# EAGLE design IMArduino-v1 (EAGLE 9.2.0)
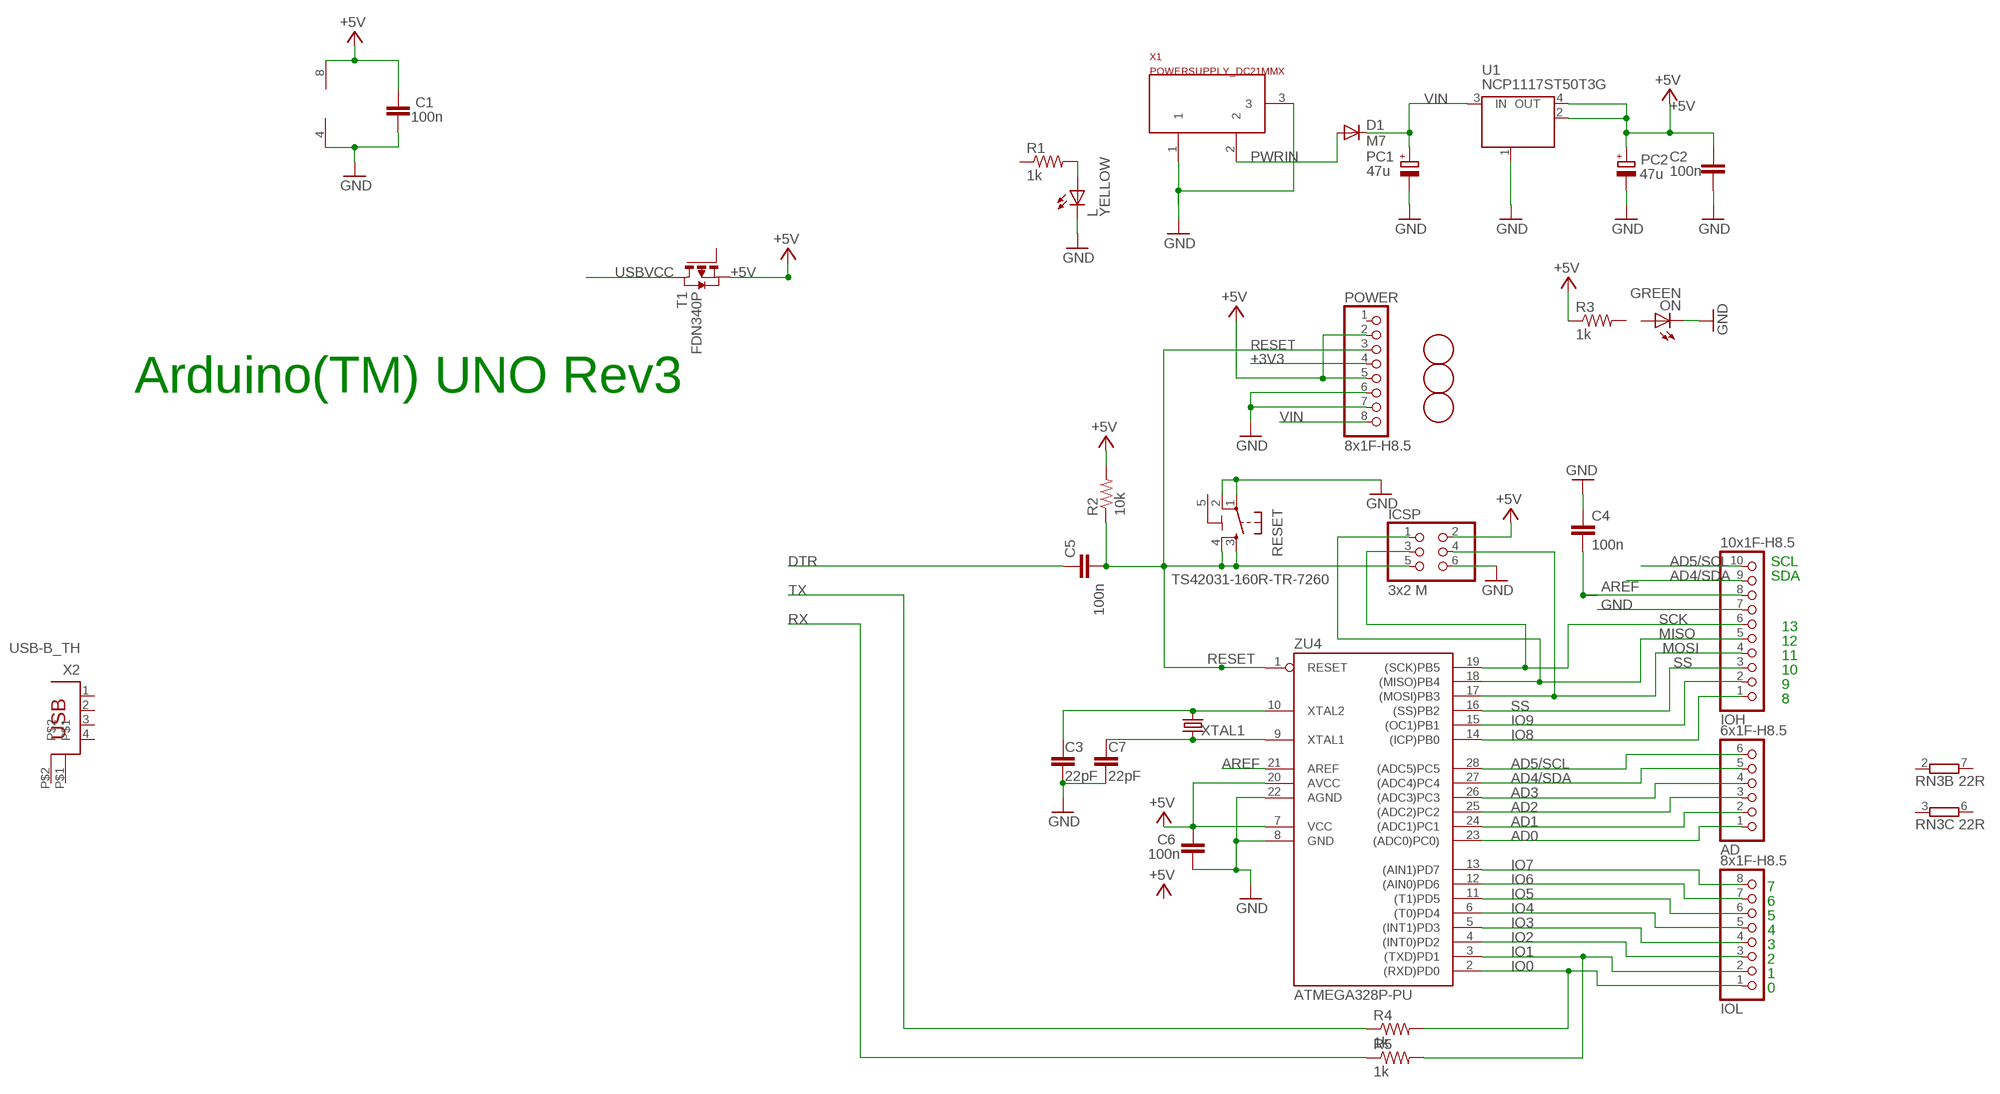
[diagram p0: schematic, sheet 1]

## Parts
AD  6x1F-H8.5  PINHD-1X6  [1X06]
C1  100n  C-EU0603-RND  [C0603-ROUND]
C2  100n  C-EU0603-RND  [C0603-ROUND]
C3  22pF  C-EU0603-RND  [C0603-ROUND]
C4  100n  C-EU0603-RND  [C0603-ROUND]
C5  100n  C-EU0603-RND  [C0603-ROUND]
C6  100n  C-EU0603-RND  [C0603-ROUND]
C7  22pF  C-EU0603-RND  [C0603-ROUND]
D1  M7  DIODE-SMB  [SMB]
FD1  FIDUCIALMOUNT  [FIDUCIA-MOUNT]
FD2  FIDUCIALMOUNT  [FIDUCIA-MOUNT]
FD3  FIDUCIALMOUNT  [FIDUCIA-MOUNT]
ICSP  3x2 M  PINHD-2X3  [2X03]
IOH  10x1F-H8.5  PINHD-1X10_ARD  [1X10]
IOL  8x1F-H8.5  PINHD-1X8  [1X08]
L  YELLOW  LEDCHIP-LED0805  [CHIP-LED0805]
ON  GREEN  LEDCHIP-LED0805  [CHIP-LED0805]
PC1  47u  CPOL-EUD  [PANASONIC_D]
PC2  47u  CPOL-EUD  [PANASONIC_D]
POWER  8x1F-H8.5  PINHD-1X8  [1X08]
R1  1k  R-US_0204/7  [0204/7]
R2  10k  R-US_0204/7  [0204/7]
R3  1k  R-US_0204/7  [0204/7]
R4  1k  R-US_0204/7  [0204/7]
R5  1k  R-US_0204/7  [0204/7]
RESET  TS42031-160R-TR-7260  TS42  [TS42]
RN3  22R  4R-NCAY16  [CAY16]
T1  FDN340P  PMOSSOT23  [SOT-23]
U1  NCP1117ST50T3G  MC33269ST-3.3T3  [SOT223]
U5  LMV358IDGKR  LMV358MMX  [MSOP08]
X1  POWERSUPPLY_DC21MMX  [POWERSUPPLY_DC-21MM]
X2  USB-B_TH  PN61729  [PN61729]
XTAL1  CRYSTALHC49U-V  [HC49U-V]
ZU4  ATMEGA328P-PU  [DIL28-3]

## Nets
+3V3: POWER.4
+5V [usbvcc]: C1.2 C2.2 C6.2 ICSP.2 PC2.+ POWER.2 POWER.5 R2.2 R3.1 T1.2(S) U1.2(OUT) U1.4(OUT) U5.8(P:V+) ZU4.7(VCC) ZU4.20(AVCC)
AD0: AD.1 ZU4.23((ADC0)PC0))
AD1: AD.2 ZU4.24((ADC1)PC1)
AD2: AD.3 ZU4.25((ADC2)PC2)
AD3: AD.4 ZU4.26((ADC3)PC3)
AD4/SDA: AD.5 IOH.9 ZU4.27((ADC4)PC4)
AD5/SCL: AD.6 IOH.10 ZU4.28((ADC5)PC5)
AREF [aref]: C4.2 IOH.8 ZU4.21(AREF)
DTR: C5.1
GND [gnd]: C1.1 C2.1 C3.1 C4.1 C6.1 C7.1 ICSP.6 IOH.7 L.C ON.C PC1.- PC2.- POWER.6 POWER.7 RESET.1 RESET.2 U1.1(GND/ADJ) U5.4(P:V-) X1.1 X1.3 ZU4.8(GND) ZU4.22(AGND)
IO0: IOL.1 R4.2 ZU4.2((RXD)PD0)
IO1: IOL.2 R5.2 ZU4.3((TXD)PD1)
IO2: IOL.3 ZU4.4((INT0)PD2)
IO3: IOL.4 ZU4.5((INT1)PD3)
IO4: IOL.5 ZU4.6((T0)PD4)
IO5: IOL.6 ZU4.11((T1)PD5)
IO6: IOL.7 ZU4.12((AIN0)PD6)
IO7: IOL.8 ZU4.13((AIN1)PD7)
IO8: IOH.1 ZU4.14((ICP)PB0)
IO9: IOH.2 ZU4.15((OC1)PB1)
MISO: ICSP.1 IOH.5 ZU4.18((MISO)PB4)
MOSI: ICSP.4 IOH.4 ZU4.17((MOSI)PB3)
N$1: L.A R1.2
PWRIN [power]: D1.A X1.2
RESET: C5.2 ICSP.5 POWER.3 R2.1 RESET.3 RESET.4 ZU4.1(RESET)
RX: R5.1
SCK: ICSP.3 IOH.6 ZU4.19((SCK)PB5)
SS: IOH.3 ZU4.16((SS)PB2)
TX: R4.1
USBVCC [usbvcc]: T1.1(D)
VIN [power]: D1.C PC1.+ POWER.8 U1.3(IN)
XTAL1: C7.2 XTAL1.1 ZU4.9(XTAL1)
XTAL2: C3.2 XTAL1.2 ZU4.10(XTAL2)
Unconnected: ON.A POWER.1 R1.1 R3.2 RN3.1 RN3.2 RN3.3 RN3.4 RN3.5 RN3.6 RN3.7 RN3.8 T1.3(G) U5.1(A:OUT) U5.2(A:-IN) U5.3(A:+IN) U5.5(B:+IN) U5.6(B:-IN) U5.7(B:OUT) X2.1 X2.2 X2.3 X2.4 X2.P$1 X2.P$2

## Notes on the sheet
- Arduino(TM) UNO Rev3
- SCL
- SDA
- 13
- 12
- 11
- 10
- 9
- 8
- 7
- 6
- 5
- 4
- 3
- 2
- 1
- 0

## Power pins joined to a net without a drawn wire
5-GND: RESET.5(5-GND)

## Library data of the parts
AD = SmartPrj:PINHD-1X6: PIN HEADER
C1-C7 = SmartPrj:C-EU: CAPACITOR, European symbol
D1 = diode:DIODE-: DIODE
FD1-FD3 = SmartPrj:FIDUCIALMOUNT
ICSP = SmartPrj:PINHD-2X3: PIN HEADER
IOH = SmartPrj:PINHD-1X10_ARD: PIN HEADER
IOL POWER = SmartPrj:PINHD-1X8: PIN HEADER
L ON = led:LED: LED OSRAM: - CHIPLED LG R971, LG N971, LY N971, LG Q971, LY Q971, LO R971, LY R971 LH N974, LH R974 LS Q976, LO Q976, LY Q976 LO Q996 - Hyper CHIPLED LW Q18S LB Q993, LB Q99A, LB R99A - SideLED LS A670, LO A670, LY A670, LG A670, LP A670 LB A673, LV A673, LT A673, LW A673 LH A674 LY A675 LS A676, LA A676, LO A676, LY A676, LW A676 LS A679, LY A679, LG A679 - Hyper Micro SIDELED® LS Y876, LA Y876, LO Y876, LY Y876 LT Y87S - SmartLED LW L88C, LW L88S LB L89C, LB L89S, LG L890 LS L89K, LO L89K, LY L89K LS L896, LA L896, LO L896, LY L896 - TOPLED LS T670, LO T670, LY T670, LG T670, LP T670 LSG T670, LSP T670, LSY T670, LOP T670, LYG T670 LG T671, LOG T671, LSG T671 LB T673, LV T673, LT T673, LW T673 LH T674 LS T676, LA T676, LO T676, LY T676, LB T676, LH T676, LSB T676, LW T676 LB T67C, LV T67C, LT T67C, LS T67K, LO T67K, LY T67K, LW E67C LS E67B, LA E67B, LO E67B, LY E67B, LB E67C, LV E67C, LT E67C LW T67C LS T679, LY T679, LG T679 LS T770, LO T770, LY T770, LG T770, LP T770 LB T773, LV T773, LT T773, LW T773 LH T774 LS E675, LA E675, LY E675, LS T675 LS T776, LA T776, LO T776, LY T776, LB T776 LHGB T686 LT T68C, LB T68C - Hyper Mini TOPLED® LB M676 - Mini TOPLED Santana® LG M470 LS M47K, LO M47K, LY M47K Source: http://www.osram.convergy.de LUXEON: - LUMILED® LXK2-PW12-R00, LXK2-PW12-S00, LXK2-PW14-U00, LXK2-PW14-V00 LXK2-PM12-R00, LXK2-PM12-S00, LXK2-PM14-U00 LXK2-PE12-Q00, LXK2-PE12-R00, LXK2-PE12-S00, LXK2-PE14-T00, LXK2-PE14-U00 LXK2-PB12-K00, LXK2-PB12-L00, LXK2-PB12-M00, LXK2-PB14-N00, LXK2-PB14-P00, LXK2-PB14-Q00 LXK2-PR12-L00, LXK2-PR12-M00, LXK2-PR14-Q00, LXK2-PR14-R00 LXK2-PD12-Q00, LXK2-PD12-R00, LXK2-PD12-S00 LXK2-PH12-R00, LXK2-PH12-S00 LXK2-PL12-P00, LXK2-PL12-Q00, LXK2-PL12-R00 Source: www.luxeon.com KINGBRIGHT: KA-3528ASYC Source: www.kingbright.com
PC1 PC2 = rcl:CPOL-EU: POLARIZED CAPACITOR, European symbol
R1-R5 = adafruit:R-US_: RESISTOR, American symbol
RESET = SmartPrj:TS42: TS42 Dongnan Electronics Tact switch VDC 12V - 50mA
RN3 = resistor-dil:4R-N: Array Chip Resistor Source: RS Component / Phycomp
T1 = zetex:PMOSSOT23: MOS FET
U1 = linear:MC33269ST*: Adjustable Output Low Dropout Voltage Regulator 800 mA Source: http://www.onsemi.com/pub/Collateral/MC33269-D.PDF
U5 = linear:LMV358?*: Dual General Purpose, Low Voltage, Rail-to-Rail Output Operational Amplifiers Source: http://www.national.com/mpf/LM/LMV321.html http://www.national.com/dt/lmv_qual.pdf
X1 = SmartPrj:POWERSUPPLY_DC21MM
X2 = SmartPrj:PN61729: BERG USB connector
XTAL1 = adafruit:CRYSTAL: CRYSTAL; OC_FARNELL: 1666969; OC_NEWARK: unknown
ZU4 = SmartPrj:ATMEGA328P-: MICROCONTROLLER 4 Kbytes FLASH 128 bytes SRAM 256 bytes EEPROM UART 6-channel 10 bit ADC

## Net classes
0 default: width 0.254 mm, clearance 0.254 mm
1 power: width 0.61 mm, drill 0.61 mm, clearance 0.254 mm
2 gnd: width 0.305 mm, drill 0.559 mm, clearance 0.254 mm
3 usbvcc: width 0.508 mm, drill 0.61 mm, clearance 0.254 mm
4 aref: width 0.406 mm, drill 0.61 mm, clearance 0.254 mm

## Board
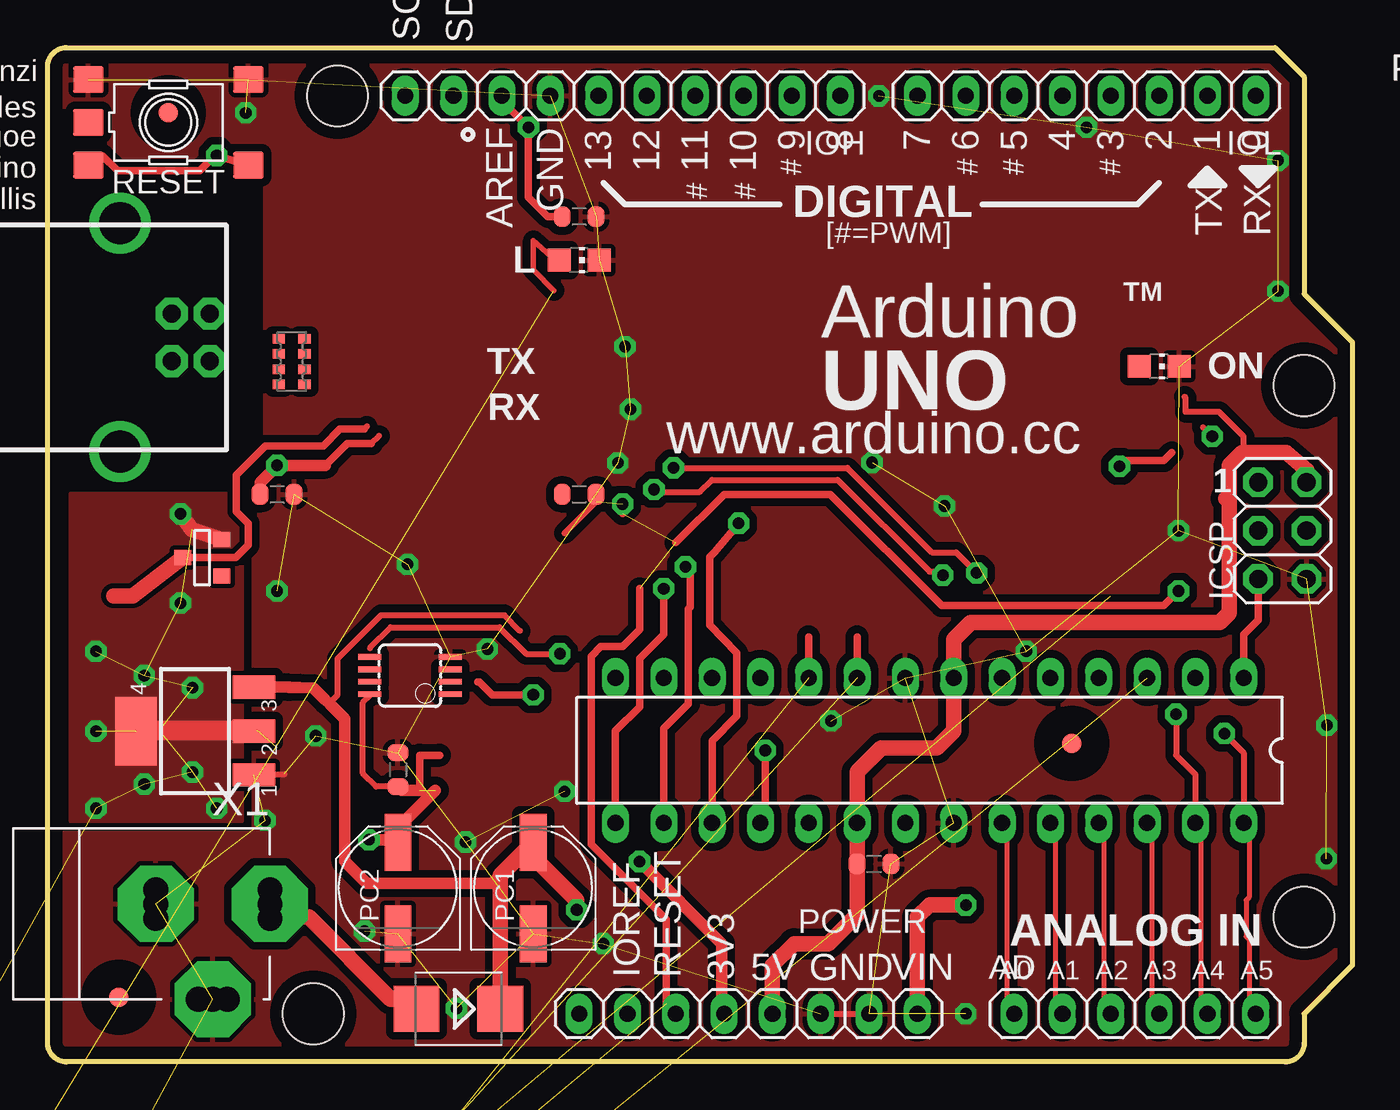
[diagram p1: board, top side]
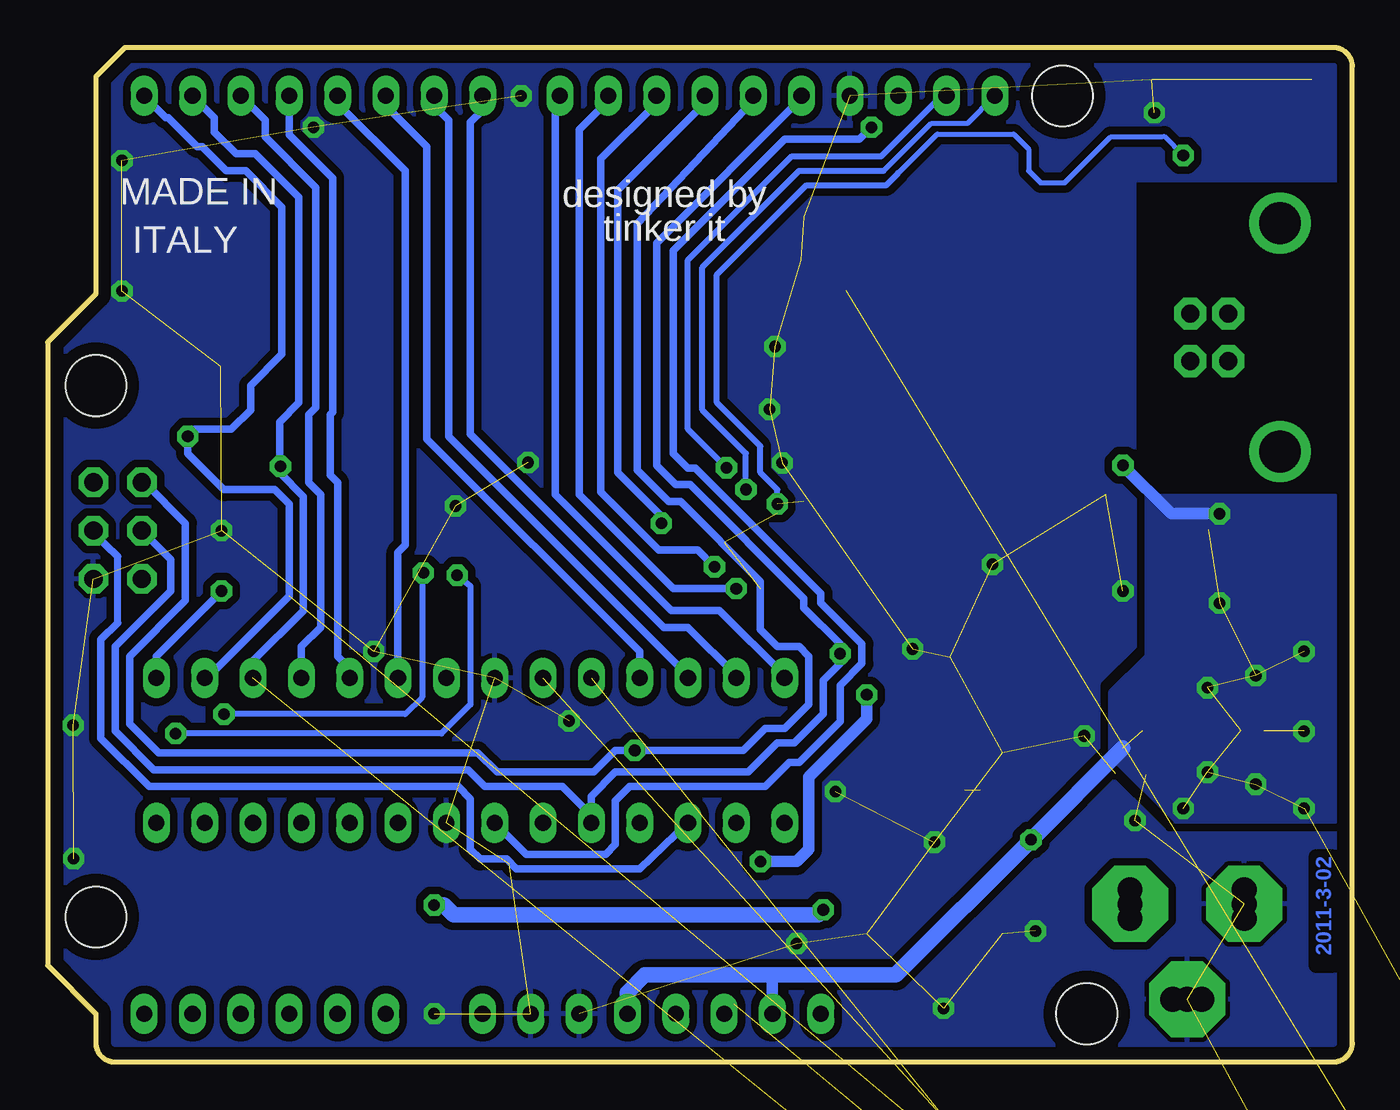
[diagram p2: board, bottom side, seen from below]

Size 68.58 x 53.34 mm. Coordinates in mm from the lower left corner, seen from the top.
Outline: 64.52,53.34 66.04,51.82 66.04,40.39 68.58,37.85 68.58,5.08 66.04,2.54 66.04,1 arc-90 65.04,0 1,0 arc-90 0,1 0,52.34 arc-90 1,53.34 64.52,53.34
Copper layers (1*16): Top 0.035mm / dielectric 1.5mm / Bottom 0.035mm
Design rules "default": minimum track width 10mil, minimum drill 22mil, track to track 10mil, track to pad 10mil, pad to pad 10mil, via to via 12mil, smd to smd 8mil, copper to edge 26mil, drill to drill 12mil, minimum pad ring 10mil, minimum via ring 10mil, stop-mask expansion 1mil, vias tented up to drill 30mil, thermal gap 10mil
Holes 3.2 mm at 66.04,35.56 66.04,7.62 15.24,50.8 13.97,2.54
vRestrict: area 22.9,44.1 to 24.6,49.1; area 25.4,45.5 to 27.1,49.1; area 28.4,45.3 to 29.6,48.8; area 31,45.3 to 32.1,48.8; area 33.5,45.3 to 34.7,48.8; area 36.1,45.3 to 37.2,48.8; area 38.7,47.2 to 39.9,48.8; area 40.3,45.1 to 47.6,46.9; area 60.3,44.2 to 61.7,46.7; area 62.9,44.2 to 64.3,46.7; area 61.3,35.8 to 64.8,37.2; area 0.6,21.8 to 2,30.1; area 5.7,22.6 to 7.4,30.1; area 47.9,10.3 to 48.5,10.8; area 50.4,10.2 to 50.9,11; area 11.3,28.8 to 12.7,31.1; area 44.8,47.5 to 46.1,48.9; area 47.6,47.4 to 48.8,48.9; area 50.2,47.4 to 51.3,48.9; area 52.8,47.4 to 54,48.9; area 55.2,47.4 to 56.4,48.9; area 57.9,47.4 to 59.1,48.9; area 60.5,47.4 to 61.6,48.9; area 63,47.4 to 64.1,48.9; area 41.3,47.2 to 42.4,48.8; area 0.3,12.4 to 9.4,24.5

### Footprints (pad centres in the part's own frame; a part is rotated, then mirrored left to right if it is on the bottom)
1X06 = drill 0.85 pad 1.422 long: 1 -6.35,0; 2 -3.81,0; 3 -1.27,0; 4 1.27,0; 5 3.81,0; 6 6.35,0
C0603-ROUND = smd 0.898 x 1.1: 1 -0.889,0; 2 0.889,0
SMB = smd 2.4 x 2.4: A 2.2,0; C -2.2,0
FIDUCIA-MOUNT = smd 1.016 x 1.016: P$1 0,0
2X03 = drill 0.95 pad 1.55 octagon: 1 -2.54,-1.27; 2 -2.54,1.27; 3 0,-1.27; 4 0,1.27; 5 2.54,-1.27; 6 2.54,1.27
1X10 = drill 0.85 pad 1.422 long: 1 -11.43,0; 2 -8.89,0; 3 -6.35,0; 4 -3.81,0; 5 -1.27,0; 6 1.27,0; 7 3.81,0; 8 6.35,0; 9 8.89,0; 10 11.43,0
1X08 = drill 0.85 pad 1.422 long: 1 -8.89,0; 2 -6.35,0; 3 -3.81,0; 4 -1.27,0; 5 1.27,0; 6 3.81,0; 7 6.35,0; 8 8.89,0
CHIP-LED0805 = smd 1.2 x 1.2: A 0,-1.05; C 0,1.05
PANASONIC_D = smd 3 x 1.4: + 2.4,0; - -2.4,0
0204/7 = drill 0.813 pad 1.676 octagon: 1 -3.81,0; 2 3.81,0
TS42 = smd 1.6 x 1.4: 1 -4.2,2.25; 2 4.2,2.25; 3 -4.2,-2.25; 4 4.2,-2.25; 5 -4.2,0
CAY16 = smd 0.5 x 0.65: 1 -1.2,-0.675; 2 -0.4,-0.675; 3 0.4,-0.675; 4 1.2,-0.675; 5 1.2,0.675; 6 0.4,0.675; 7 -0.4,0.675; 8 -1.2,0.675
SOT-23 = smd 0.787 x 0.889: 1 0.025,-1.016; 2 -0.94,1.016; 3 0.991,1.016
SOT223 = smd 1.219 x 2.235: 1 -2.311,-3.099; 2 0,-3.099; 3 2.311,-3.099 | smd 3.6 x 2.2: 4 0,3.099
MSOP08 = smd 0.3 x 1.2: 1 -0.976,-2.113; 2 -0.326,-2.113; 3 0.324,-2.113; 4 0.974,-2.113; 5 0.974,2.112; 6 0.324,2.112; 7 -0.326,2.112; 8 -0.976,2.112
POWERSUPPLY_DC-21MM = drill 1.3 pad 4 octagon: 1 -5.08,-3.353; 2 -0.076,-6.35; 3 -0.076,-0.356 | drill 1.3: 4 -5.08,-4.115; 5 -5.08,-2.591; 6 -0.838,-0.356; 7 0.686,-0.356; 8 -0.838,-6.35; 9 0.686,-6.35
PN61729 = drill 0.95 pad 1.676 octagon: 1 1.25,4.71; 2 -1.25,4.71; 3 -1.25,2.71; 4 1.25,2.71 | drill 2.2: P$1 -6,0; P$2 6,0
HC49U-V = drill 0.813: 1 -2.413,0; 2 2.413,0
DIL28-3 = drill 0.85 pad 1.422 long: 1 -16.51,-3.81; 2 -13.97,-3.81; 3 -11.43,-3.81; 4 -8.89,-3.81; 5 -6.35,-3.81; 6 -3.81,-3.81; 7 -1.27,-3.81; 8 1.27,-3.81; 9 3.81,-3.81; 10 6.35,-3.81; 11 8.89,-3.81; 12 11.43,-3.81; 13 13.97,-3.81; 14 16.51,-3.81; 15 16.51,3.81; 16 13.97,3.81; 17 11.43,3.81; 18 8.89,3.81; 19 6.35,3.81; 20 3.81,3.81; 21 1.27,3.81; 22 -1.27,3.81; 23 -3.81,3.81; 24 -6.35,3.81; 25 -8.89,3.81; 26 -11.43,3.81; 27 -13.97,3.81; 28 -16.51,3.81

### Placement (x,y rotation side)
AD  57.15,2.54 0 top
C1  18.41,15.37 270 top
C2  12.06,29.84 180 top
C3  -21.21,-53.34 0 top  (outside the outline)
C4  27.94,44.45 180 top
C5  27.94,29.84 0 top
C6  43.43,10.41 180 top
C7  -21.21,-58.55 0 top  (outside the outline)
D1  21.59,2.79 180 top
FD1  6.35,49.91 0 top
FD2  53.84,16.74 0 top
FD3  3.73,3.41 0 top
ICSP  64.9,27.94 270 top
IOH  30.23,50.8 180 top
IOL  54.61,50.8 180 top
L  27.94,42.16 270 top
ON  58.42,36.58 270 top
PC1  25.53,9.14 90 top
PC2  18.41,9.14 90 top
POWER  36.83,2.54 0 top
R1  -17.91,-26.29 0 top  (outside the outline)
R2  -17.91,-42.04 0 top  (outside the outline)
R3  -17.91,-30.23 0 top  (outside the outline)
R4  -17.91,-34.16 0 top  (outside the outline)
R5  -17.91,-38.1 0 top  (outside the outline)
RESET  6.35,49.4 0 top
RN3  12.83,36.83 90 top
T1  8.13,26.54 270 top
U1  7.75,17.4 90 top
U5  19.05,20.32 90 top
X1  5.33,8.38 90 top
X2  3.81,38.1 270 top
XTAL1  -17.02,-47.88 0 top  (outside the outline)
ZU4  46.35,16.38 180 top

### Tracks (layer width: path | path; a pad name or v marks a point on that pad's centre or on a via)
+3V3  (via drill 0.61)
  Top 0.406: 22.61,19.99 22.68,19.99 23.37,19.3 v25.53,19.3
  Top 0.61: v31.11,10.54 35.43,6.22 35.43,2.67 POWER.4
  Bottom 0.61: v31.11,10.54 29.21,10.54 28.57,11.18 28.57,14.99 25.53,18.03 v25.53,19.3
+5V  (via drill 0.61)  (14 unrouted)
  Top 0.305: 59.76,34.98 59.82,34.92 59.82,34.18 61.58,34.18 62.87,32.89 62.87,32.05 | 17.02,32.51 17.43,32.92 | U5.8 16.98,19.3 16.57,18.9 16.57,15.18 17.27,14.48 C1.2
  Top 0.406: 42.55,10.16 42.35,10.35 | 17.02,32.51 15.75,32.51 14.61,31.37 | 20.61,16.13 19.56,16.13 19.56,14.29
  Top 0.508: 11.02,17.42 U1.2 | ICSP.2 66.04,30.48
  Top 0.61: C6.2 42.58,10.88 42.55,11.43 | 11.05,29.72 C2.2 11.18,30.48 v12.06,31.37 14.61,31.37 | v16.89,11.68 18.78,11.68 PC2.+ 18.41,12.32 20.39,14.29 | C1.2 18.6,14.29 19.56,14.29
  Top 0.813: 66.17,30.44 ICSP.2 66.17,31.11 65.1,32.05 62.87,32.05 62.79,32.05 62.1,31.37 62.1,29.46 | 62.1,29.46 62.1,23.62 61.59,23.11 48.51,23.11 47.62,22.23 ZU4.7 47.62,17.4 46.74,16.51 43.81,16.51 42.55,15.24 ZU4.20 42.55,11.43 C6.2 42.55,10.16 42.55,7.75 41.02,6.22 39.24,6.22 38.1,5.08 POWER.5 | T1.2 7.57,27.99 v6.99,28.83 | 62.1,29.46 61.93,29.64
  Top 1.016: U1.4 5.84,17.4 5.87,17.42 11.02,17.42
  Bottom 0.61: POWER.2 30.48,4.7 30.61,4.57 | v12.06,31.37 9.53,28.83 v6.99,28.83
  Bottom 0.813: POWER.5 38.12,3.63 37.19,4.57 30.61,4.57 24,4.57 v16.89,11.68 12.06,16.51
  other vias: 2.54,21.59 5.08,20.32 6.99,24.13 2.54,13.34 5.08,14.61 2.54,17.4 8.89,13.34 7.62,15.24 7.62,19.68
  pour Bottom (isolate 0.406, no thermals): 0.89,29.72 10.79,29.72 10.79,21.34 12.7,19.43 12.7,16.13 9.27,12.7 0.89,12.7
  pour Top (no thermals): 1.27,12.7 1.27,29.84 10.16,29.84 10.16,12.7
AD0
  Top 0.254: ZU4.23 50.44,12.17 50.44,3 AD.1
AD1
  Top 0.254: ZU4.24 52.98,12.17 52.98,3 AD.2
AD2
  Top 0.254: ZU4.25 55.52,12.17 55.52,3 AD.3
AD3
  Top 0.254: ZU4.26 58.06,12.17 58.06,3 AD.4
AD4/SDA  (via drill 0.61)
  Top 0.254: ZU4.27 60.6,12.17 60.6,3 AD.5
  Top 0.305: v32.89,31.24 42.04,31.24 46.48,26.8 47.75,26.8 v48.83,25.72 49.02,25.65 | v59.31,18.29 59.31,16.13 60.33,15.11 ZU4.27
  Bottom 0.305: IOH.9 21.59,50.8 24.77,47.62 29.46,47.62 34.92,42.16 34.92,33.27 v32.89,31.24 | v48.83,25.72 48.9,25.65 48.9,19.18 49.78,18.29 v59.31,18.29
AD5/SCL  (via drill 0.61)
  Top 0.254: ZU4.28 63.14,12.17 63.14,8.66 62.99,8.51 62.99,6.6 63.14,6.45 63.14,3 AD.6
  Top 0.305: v31.88,30.1 31.88,29.97 34.29,29.97 34.92,30.61 41.53,30.61 46.35,25.78 46.86,25.78 v47.05,25.59 | ZU4.28 62.87,16.26 v61.85,17.27
  Bottom 0.254: IOH.10 20.22,49.35 22.12,49.35 24.64,46.86
  Bottom 0.305: v61.85,17.27 47.88,17.27 46.35,18.8 46.35,25.02 v47.05,25.59 | v31.88,30.1 31.88,32 34.16,34.29 34.16,41.78 29.08,46.86 24.64,46.86
AREF  (via drill 0.61)
  Top 0.406: IOH.8 23.88,50.55 v25.27,49.15 25.27,45.47 26.29,44.45 C4.2
  Bottom 0.406: ZU4.21 43.43,10.92 39.24,10.92 38.73,11.43 38.73,13.72 37.97,14.48 30.86,14.48 29.59,15.75 29.08,15.75 26.92,17.91 26.92,19.81 25.78,20.95 25.78,21.97 27.94,24.13 27.94,24.64 34.54,31.24 34.92,31.24 35.69,32 35.69,42.67 29.84,48.51 25.91,48.51 v25.27,49.15
GND  (via drill 0.61)  (46 unrouted)
  Top 0.305: POWER.6 POWER.7 | U1.1 12.45,15.14
  other vias: 29.21,6.22 27.18,14.22 16.66,6.88 30.63,34.32 54.61,49.15 30.35,37.62 11.43,12.7 41.17,17.93 51.44,21.59 29.97,31.5 43.69,50.8 48.26,2.54 59.44,27.94 21.49,2.82 67.21,10.69 64.67,47.4 12.06,24.77 67.23,17.7 23.11,21.72 10.41,49.91 47.14,29.24 18.92,26.16 43.33,31.52 21.97,11.56 14.1,17.14 64.67,40.54
  pour Bottom (isolate 0.406, rank 2): 0.64,52.7 67.69,52.7 67.94,52.45 67.94,0.64 0.89,0.64 0.64,0.89 0.64,30.1 11.43,30.1 11.43,46.35 0.64,46.35
  pour Top (isolate 0.406, rank 2): 0.64,52.7 67.94,52.7 67.94,0.64 0.64,0.64 0.51,30.48 11.43,30.48 11.43,46.35 0.64,46.35
IO0  (via drill 0.61)  (1 unrouted)
  Top 0.305: v61.21,32.89 60.73,33.38
  Bottom 0.406: ZU4.2 60.2,20.19 55.88,24.51 55.88,29.34 56.64,30.1 59.31,30.1 61.21,32 v61.21,32.89 60.83,33.27 58.93,33.27 57.91,34.29 57.91,35.56 56.26,37.21 56.26,44.96 58.17,46.86 59.18,46.86 60.45,48.13 60.71,48.13 62.23,49.66 62.36,49.66 IOL.1
IO1  (via drill 0.61)  (1 unrouted)
  Top 0.406: 59.09,32.04 58.67,31.62 56.64,31.62 v56.34,31.32
  Bottom 0.406: ZU4.3 57.78,21.08 55.14,23.72 55.14,29.74 56.39,30.99 56.39,31.11 v56.34,31.32 56.39,31.37 56.39,33.66 55.37,34.67 55.37,45.47 57.66,47.75 58.67,47.75 59.82,48.9 59.82,49.66 IOL.2
IO2
  Bottom 0.406: ZU4.4 55.24,21.84 54.23,22.86 54.23,29.84 54.86,30.48 54.86,34.04 54.48,34.42 54.48,45.97 57.15,48.64 57.15,49.53 IOL.3
IO3
  Bottom 0.406: ZU4.5 52.7,20.7 53.34,21.34 53.34,30.48 53.72,30.86 53.72,34.04 53.59,34.16 53.59,46.48 55.88,48.77 IOL.4
IO4
  Bottom 0.406: IOL.5 53.21,50.29 49.78,46.86 49.78,27.18 50.16,26.8 ZU4.6
IO5
  Bottom 0.406: IOL.6 50.8,50.29 48.64,48.13 48.64,32.77 37.47,21.59 ZU4.11
IO6
  Bottom 0.406: IOL.7 48.26,50.29 47.5,49.53 47.5,32.89 34.92,20.32 ZU4.12
IO7
  Bottom 0.406: IOL.8 45.72,50.04 46.35,49.4 46.35,33.02 36.2,22.86 34.92,22.86 32.38,20.32 ZU4.13
IO8
  Bottom 0.406: ZU4.14 29.84,20.32 33.27,23.75 35.81,23.75 41.91,29.84 41.91,50.55 41.66,50.29 IOH.1
IO9  (via drill 0.61)
  Top 0.406: ZU4.15 29.84,17.4 31.11,18.67 31.11,21.21 32.38,22.48 v32.38,24.89
  Bottom 0.406: v32.38,24.89 35.69,24.89 40.64,29.84 40.64,49.02 39.12,50.55 IOH.2
MISO  (via drill 0.61)
  Top 0.406: v37.72,16.38 37.72,12.83 ZU4.18
  Bottom 0.406: IOH.5 31.5,50.55 37.59,44.07 37.59,31.11 35.94,29.46 35.31,29.46 31.11,25.27 31.11,22.73 30.23,21.84 29.08,21.84 28.57,21.34 28.57,18.8 29.84,17.53 30.86,17.53 32,16.38 v37.72,16.38 | ICSP.1 63.45,30.43 61.34,28.32 61.34,24.26 64.26,21.34 64.26,17.78 62.74,16.26 45.97,16.26 44.96,15.24 39.88,15.24 38.73,16.38 v37.72,16.38 | v37.72,16.38 37.85,16.13 37.85,16.26
MOSI  (via drill 0.61)
  Top 0.406: ZU4.17 34.92,16.89 36.22,18.19 36.22,21.51 34.8,22.99 34.8,26.54 35.05,26.8 v36.32,28.32
  Bottom 0.381: 64.9,23.09 64.9,26.57
  Bottom 0.406: IOH.4 34.04,50.42 38.61,45.85 38.61,30.99 36.32,28.7 v36.32,28.32 | ICSP.4 66.18,27.83 64.9,26.57 | 64.9,23.09 65.79,22.23 65.79,17.02 63.25,14.48 46.99,14.48 46.35,13.84 46.35,11.18 45.85,10.67 44.45,10.67 43.94,10.16 37.47,10.16 ZU4.17
N$1  (1 unrouted)
  Top 0.279: 26.61,40.57 25.53,41.66 25.53,43.18 26.67,42.16 L.A
PWRIN
  Top 0.813: D1.A 18.88,3.3 18.03,3.3 13.72,7.62 12.37,7.62 X1.2
  Bottom 0.813: X1.2 11.73,8.26
RESET  (via drill 0.61)  (4 unrouted)
  Top 0.305: C5.2 28.83,29.46 27.18,27.81
  Top 0.406: ICSP.5 63.64,23.25 62.87,22.48 ZU4.1 | POWER.3 32.51,3.05 32.51,7.49 28.57,11.43 28.57,21.34 29.08,21.84 30.23,21.84 31.11,22.73 31.11,24.89 | RESET.3 2.88,47.66 3.68,46.86 8,46.86 8.76,47.62 v8.89,47.66 RESET.4 | 30.23,28.83 v30.23,29.34 | 33.02,27.3 35.56,29.84 41.15,29.84 46.99,24 58.67,24 v59.44,24.77
  Bottom 0.254: v8.89,47.66 9.89,48.67 10.05,48.64 12.7,48.64 15.11,46.23 16.38,46.23 17.02,46.86 17.02,48.01 17.8,48.79 21.82,48.79 23.88,46.74
  Bottom 0.305: 23.88,46.74 24.51,46.1 28.7,46.1 33.4,41.4 33.4,34.67 31.11,32.38 31.11,30.99 30.23,30.1 v30.23,29.34
  Bottom 0.406: v59.44,24.77 62.87,21.34 ZU4.1
SCK  (via drill 0.61)
  Top 0.305: v26.92,21.46 25.15,21.46 23.75,22.86 18.03,22.86 16.94,21.76
  Bottom 0.406: ICSP.3 62.1,26.42 62.1,24.77 65.02,21.84 65.02,17.4 62.99,15.37 46.48,15.37 45.59,14.48 41.53,14.48 40.01,12.95 | 40.01,12.95 40.01,13.97 38.73,15.24 31.75,15.24 30.23,16.76 29.34,16.76 27.81,18.29 27.81,20.07 26.92,20.95 v26.92,21.46 26.92,21.97 28.83,23.88 28.83,24.38 34.8,30.35 35.56,30.35 36.58,31.37 36.58,43.05 28.96,50.67 IOH.6 | 40.01,12.95 ZU4.19
SS  (via drill 0.61)
  Top 0.406: v33.53,26.04 33.78,25.78 33.78,23.93 33.68,23.82 33.68,18.82 32.38,17.53 ZU4.16
  Bottom 0.406: v33.53,26.04 34.42,26.92 36.45,26.92 39.5,29.97 39.5,47.5 36.58,50.42 IOH.3
USBVCC
  Top 0.305: 16.64,33.27 16.78,33.42
  Top 0.406: 16.64,33.27 15.37,33.27 14.48,32.38 11.43,32.38 9.91,30.86 9.91,28.96 10.54,28.32 10.54,27.18 9.88,26.52 T1.1
  Top 0.813: 3.47,24.51 4.47,24.51 T1.1
VIN  (via drill 0.61)
  Top 0.305: 24.82,22.68 24,23.5 17.53,23.5 15.24,21.21 15.24,19.3 14.8,18.86
  Top 0.61: 13.97,19.68 12.7,19.68 | 13.97,19.68 14.61,19.05 14.8,18.86 15.62,18.03 15.62,10.54 16.76,9.4 23.38,9.4 23.95,9.96 | 13.97,19.68 12.67,19.71 U1.3 | PC1.+ 25.54,11.43
  Top 0.813: v48.26,8.26 46.35,8.26 45.72,7.62 POWER.8 | D1.C 23.79,9.81 23.95,9.96 PC1.+ 25.53,10.79 27.81,8.51 v27.81,8
  Bottom 0.813: v48.26,8.26 47.75,8.26 47.24,7.75 28.07,7.75 v27.81,8
XTAL1  (2 unrouted)
  Top 0.406: ZU4.9 42.55,22.35
XTAL2  (2 unrouted)
  Top 0.406: ZU4.10 40.01,22.35

### Text on the board
Top: Use of the Arduino name must be compliant with http://www.arduino.cc/en/Main/Policy
Bottom: 2011-3-02
tPlace: Prototype | Edition | Limited | 13 | 12 | 11 | 10 | 9 | 8 | 7 | 6 | 5 | 4 | 3 | 2 | 1 | 0
tNames: SCL | SDA | M.Banzi | D.Cuartielles | T.Igoe | AREF | GND | G.Martino | # | # | # | # | D.Mellis | # | # | DIGITAL | [#=PWM] | TX | RX | TM | TX | Arduino | RX | UNO | www.arduino.cc | 1 | ANALOG IN | IOREF | RESET | 3V3 | 5V | GND | VIN | A0 | A1 | A2 | A3 | A4 | A5
bNames: MADE IN | designed by | MADE IN | ITALY | tinker it | ITALY | designed by | tinker it | ATMEGA328
ReferenceLC: L | TX | ON | RX | PC1 | PC2
214bmp: D:/SmartProjects/Snc/a4_bn_logo2.bmp